# Altium project Battery PCB 8x4 Rev.PrjPcb
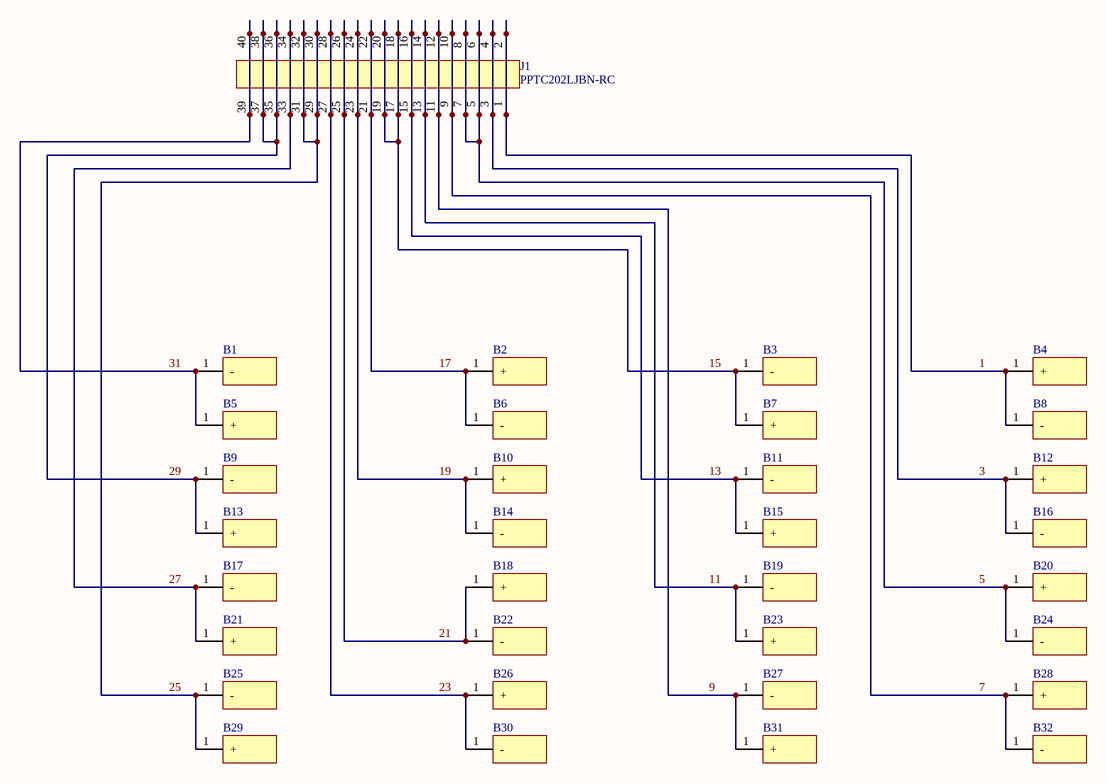
[diagram p0: Battery PCB 8x4 Rev.SchDoc]
1 sheet, 33 parts. Net scope: global (net labels, ports and power ports of the same name join across sheets).
Board file: Battery PCB 8x4 Rev.PcbDoc

## Sheet Battery PCB 8x4 Rev.SchDoc
size A4

### Parts
B1  Negative side of battery  [BF_BATT_N]  (value not drawn)  (no BOM)
B2  Positive side of battery  [BF_BATT_P]  (value not drawn)  (no BOM)
B3  Negative side of battery  [BF_BATT_N]  (value not drawn)  (no BOM)
B4  Positive side of battery  [BF_BATT_P]  (value not drawn)  (no BOM)
B5  Positive side of battery  [BF_BATT_P]  (value not drawn)  (no BOM)
B6  Negative side of battery  [BF_BATT_N]  (value not drawn)  (no BOM)
B7  Positive side of battery  [BF_BATT_P]  (value not drawn)  (no BOM)
B8  Negative side of battery  [BF_BATT_N]  (value not drawn)  (no BOM)
B9  Negative side of battery  [BF_BATT_N]  (value not drawn)  (no BOM)
B10  Positive side of battery  [BF_BATT_P]  (value not drawn)  (no BOM)
B11  Negative side of battery  [BF_BATT_N]  (value not drawn)  (no BOM)
B12  Positive side of battery  [BF_BATT_P]  (value not drawn)  (no BOM)
B13  Positive side of battery  [BF_BATT_P]  (value not drawn)  (no BOM)
B14  Negative side of battery  [BF_BATT_N]  (value not drawn)  (no BOM)
B15  Positive side of battery  [BF_BATT_P]  (value not drawn)  (no BOM)
B16  Negative side of battery  [BF_BATT_N]  (value not drawn)  (no BOM)
B17  Negative side of battery  [BF_BATT_N]  (value not drawn)  (no BOM)
B18  Positive side of battery  [BF_BATT_P]  (value not drawn)  (no BOM)
B19  Negative side of battery  [BF_BATT_N]  (value not drawn)  (no BOM)
B20  Positive side of battery  [BF_BATT_P]  (value not drawn)  (no BOM)
B21  Positive side of battery  [BF_BATT_P]  (value not drawn)  (no BOM)
B22  Negative side of battery  [BF_BATT_N]  (value not drawn)  (no BOM)
B23  Positive side of battery  [BF_BATT_P]  (value not drawn)  (no BOM)
B24  Negative side of battery  [BF_BATT_N]  (value not drawn)  (no BOM)
B25  Negative side of battery  [BF_BATT_N]  (value not drawn)  (no BOM)
B26  Positive side of battery  [BF_BATT_P]  (value not drawn)  (no BOM)
B27  Negative side of battery  [BF_BATT_N]  (value not drawn)  (no BOM)
B28  Positive side of battery  [BF_BATT_P]  (value not drawn)  (no BOM)
B29  Positive side of battery  [BF_BATT_P]  (value not drawn)  (no BOM)
B30  Negative side of battery  [BF_BATT_N]  (value not drawn)  (no BOM)
B31  Positive side of battery  [BF_BATT_P]  (value not drawn)  (no BOM)
B32  Negative side of battery  [BF_BATT_N]  (value not drawn)  (no BOM)
J1  value PPTC202LJBN-RC  [PPTC202LJBN-RC]  (hidden comment: Conn Recept 40Pos 0.1" dual row TH RA)

### Nets
1: B4.1(+) B8.1(-) J1.1 J1.2
3: B12.1(+) B16.1(-) J1.3 J1.4
5: B20.1(+) B24.1(-) J1.5 J1.6 J1.7 J1.8
7: B28.1(+) B32.1(-) J1.9 J1.10
9: B27.1(-) B31.1(+) J1.11 J1.12
11: B19.1(-) B23.1(+) J1.13 J1.14
13: B11.1(-) B15.1(+) J1.15 J1.16
15: B3.1(-) B7.1(+) J1.17 J1.18 J1.19 J1.20
17: B2.1(+) B6.1(-) J1.21 J1.22
19: B10.1(+) B14.1(-) J1.23 J1.24
21: B18.1(+) B22.1(-) J1.25 J1.26
23: B26.1(+) B30.1(-) J1.27 J1.28
25: B25.1(-) B29.1(+) J1.29 J1.30 J1.31 J1.32
27: B17.1(-) B21.1(+) J1.33 J1.34
29: B9.1(-) B13.1(+) J1.35 J1.36 J1.37 J1.38
31: B1.1(-) B5.1(+) J1.39 J1.40

### Library data of the parts
B1 B3 B6 B8 B9 B11 B14 B16 B17 B19 B22 B24 B25 B27 B30 B32 = BF_BATT_N: Dist: Digi-Key
B2 B4 B5 B7 B10 B12 B13 B15 B18 B20 B21 B23 B26 B28 B29 B31 = BF_BATT_P: Dist: Digi-Key
J1 = PPTC202LJBN-RC: Dist: Digi-Key; Dist P/N: S5534-ND; Mfg: Sullins Connector Solutions; Mfgr P/N: PPTC202LJBN-RC; Price: 2.75; HelpURL: https://drawings-pdf.s3.amazonaws.com/10494.pdf